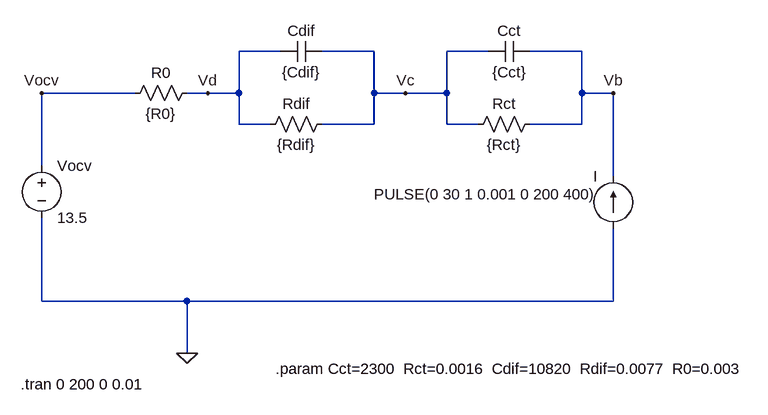
[diagram p0: schematic GP_battery.asc]
GP_battery.asc, the LTspice schematic file:
Version 4
SHEET 1 1016 680
WIRE -240 -112 -304 -112
WIRE -96 -112 -176 -112
WIRE 80 -112 16 -112
WIRE 224 -112 144 -112
WIRE -464 -48 -608 -48
WIRE -352 -48 -384 -48
WIRE -304 -48 -304 -112
WIRE -304 -48 -352 -48
WIRE -96 -48 -96 -112
WIRE -48 -48 -96 -48
WIRE 16 -48 16 -112
WIRE 16 -48 -48 -48
WIRE 224 -48 224 -112
WIRE 272 -48 224 -48
WIRE -304 0 -304 -48
WIRE -256 0 -304 0
WIRE -96 0 -96 -48
WIRE -96 0 -176 0
WIRE 16 0 16 -48
WIRE 64 0 16 0
WIRE 224 0 224 -48
WIRE 224 0 144 0
WIRE -608 64 -608 -48
WIRE 272 80 272 -48
WIRE -608 272 -608 144
WIRE -384 272 -608 272
WIRE 272 272 272 160
WIRE 272 272 -384 272
WIRE -384 352 -384 272
FLAG -384 352 0
FLAG -48 -48 Vc
FLAG -352 -48 Vd
FLAG 272 -48 Vb
FLAG -608 -48 Vocv
SYMBOL current 272 160 R180
WINDOW 0 24 80 Left 2
WINDOW 3 24 52 Left 2
WINDOW 123 0 0 Left 0
WINDOW 39 0 0 Left 0
SYMATTR InstName I
SYMATTR Value PULSE(0 30 1 0.001 0 200 400)
SYMBOL res 160 -16 R90
WINDOW 0 0 56 VBottom 2
WINDOW 3 32 56 VTop 2
SYMATTR InstName Rct
SYMATTR Value {Rct}
SYMBOL res -160 -16 R90
WINDOW 0 0 56 VBottom 2
WINDOW 3 32 56 VTop 2
SYMATTR InstName Rdif
SYMATTR Value {Rdif}
SYMBOL res -368 -64 R90
WINDOW 0 0 56 VBottom 2
WINDOW 3 32 56 VTop 2
SYMATTR InstName R0
SYMATTR Value {R0}
SYMBOL cap 144 -128 R90
WINDOW 0 0 32 VBottom 2
WINDOW 3 32 32 VTop 2
SYMATTR InstName Cct
SYMATTR Value {Cct}
SYMBOL cap -176 -128 R90
WINDOW 0 0 32 VBottom 2
WINDOW 3 32 32 VTop 2
SYMATTR InstName Cdif
SYMATTR Value {Cdif}
SYMBOL voltage -608 48 R0
WINDOW 123 0 0 Left 0
WINDOW 39 0 0 Left 0
SYMATTR InstName Vocv
SYMATTR Value 13.5
TEXT -248 376 Left 2 !.param Cct=2300  Rct=0.0016  Cdif=10820  Rdif=0.0077  R0=0.003
TEXT -640 400 Left 2 !.tran 0 200 0 0.01

The netlist it stands for:
* GP_battery.asc
I 0 Vb PULSE(0 30 1 0.001 0 200 400)
Rct Vb Vc {Rct}
Rdif Vc Vd {Rdif}
R0 Vd Vocv {R0}
Cct Vb Vc {Cct}
Cdif Vc Vd {Cdif}
Vocv Vocv 0 13.5
.param Cct=2300  Rct=0.0016  Cdif=10820  Rdif=0.0077  R0=0.003
.tran 0 200 0 0.01
.backanno
.end